# Altium schematic sheet 210806300163-李烨攀.SchDoc
size A4; Date: 2020/03/16
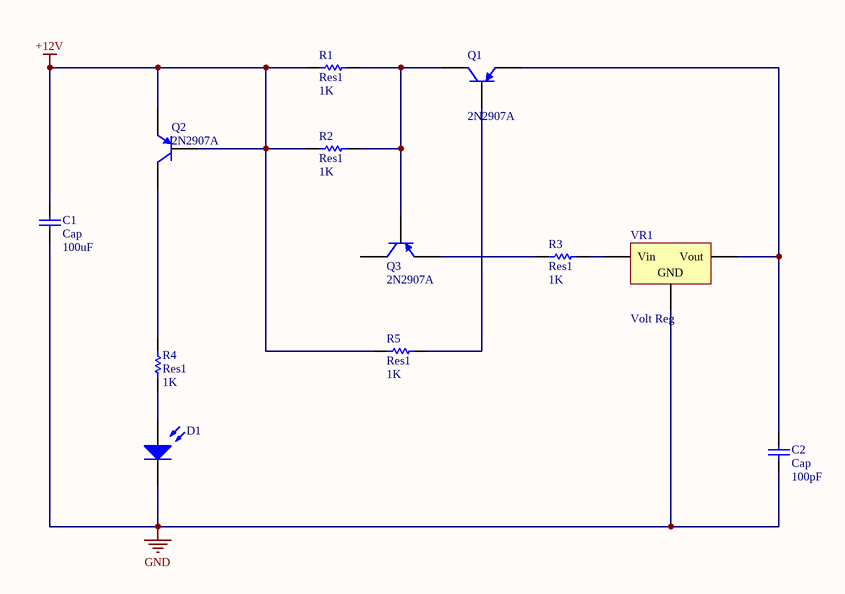
[diagram p0: 210806300163-李烨攀.SchDoc]

## Parts
C1  Cap  value 100uF  [RAD-0.3]
C2  Cap  value 100pF  [RAD-0.3]
D1  (no value)  [PIN2]
Q1  2N2907A  [TO-18]
Q2  2N2907A  [TO-18]
Q3  2N2907A  [TO-18]
R1  Res1  value 1K  [AXIAL-0.3]
R2  Res1  value 1K  [AXIAL-0.3]
R3  Res1  value 1K  [AXIAL-0.3]
R4  Res1  value 1K  [AXIAL-0.3]
R5  Res1  value 1K  [AXIAL-0.3]
VR1  Volt Reg  [TO254P1510-3_4N]

## Nets
+12V: C1.1 Q2.1(B) Q2.3(E) R1.1 R2.1 R5.1
GND: C1.2 C2.2 D1.2(K) VR1.2(GND)
NetC2_1: C2.1 Q1.3(E) VR1.3(Vout)
NetD1_1: D1.1(A) R4.2
NetQ1_1: Q1.1(B) R5.2
NetQ1_2: Q1.2(C) Q3.1(B) R1.2 R2.2
NetQ2_2: Q2.2(C) R4.1
NetQ3_3: Q3.3(E) R3.1
NetR3_2: R3.2 VR1.1(Vin)

Not connected (* = marked no-connect by the designer): Q3 2(C)

## Notes on the sheet
- 李烨攀
- 通信工程
- 专升本
- 2101班

## Library data of the parts
C1 C2 = Cap: Capacitor; Published: 8-Jun-2000; LatestRevisionDate: 17-Jul-2002; LatestRevisionNote: Re-released for DXP Platform.; PackageReference: RAD-0.3; Publisher: Altium Limited
D1 = Photo Sen: Photosensitive Diode; Published: 24-Mar-1999; LatestRevisionDate: 17-Jul-2002; LatestRevisionNote: Re-released for DXP Platform.; PackageReference: PIN2; Publisher: Altium Limited
Q1-Q3 = 2N2907A: General Purpose Amplifier and Switch; Published: 8-Jun-2000; LatestRevisionDate: 11-Dec-2002; LatestRevisionNote: Sim Port Map correction; DatasheetVersion: Nov-1997; PackageReference: TO-18; Publisher: Altium Limited; PackageDescription: Can; 3 Leads; Pin Circle Dia. 2.54 mm; Lead Dia. 0.49 mm (max); ComponentLink1Description: Manufacturer Link; ComponentLink1URL: http://www.st.com/; ComponentLink2Description: Datasheet; ComponentLink2URL: http://www.st.com/stonline/products/literature/ds/9037/2n2905a.pdf
R1-R5 = Res1: Resistor; Published: 8-Jun-2000; LatestRevisionDate: 17-Jul-2002; LatestRevisionNote: Re-released for DXP Platform.; PackageReference: AXIAL-0.3; Publisher: Altium Limited
VR1 = Volt Reg: Voltage Regulator; Published: 24-Mar-1999; LatestRevisionDate: 29-May-2009; LatestRevisionNote: IPC-7351 Footprint Added.; PackageReference: D2PAK; Publisher: Altium Limited; PackageDescription: 3-Pin Transistor Outline Package 2.54 mm Pitch, 15.1 mm Lead Span